# EAGLE board controller (EAGLE 9.6.2)
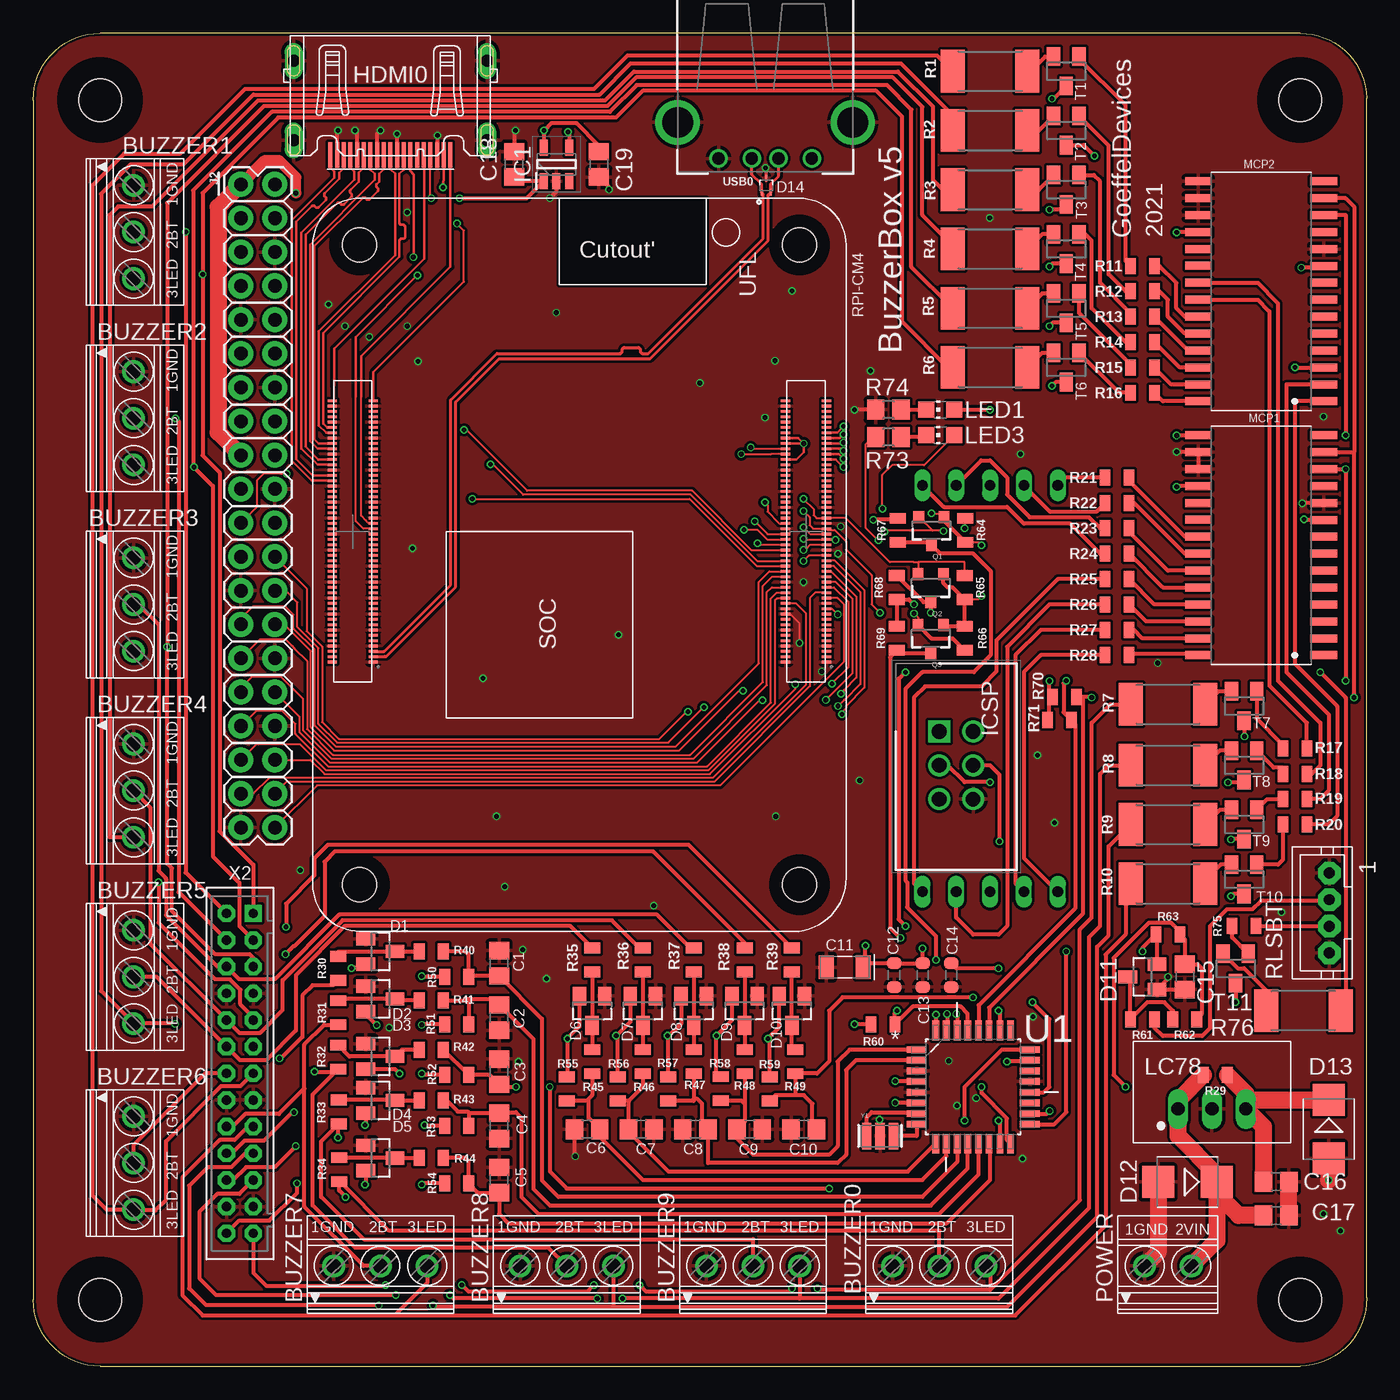
[diagram p3: board, top side]
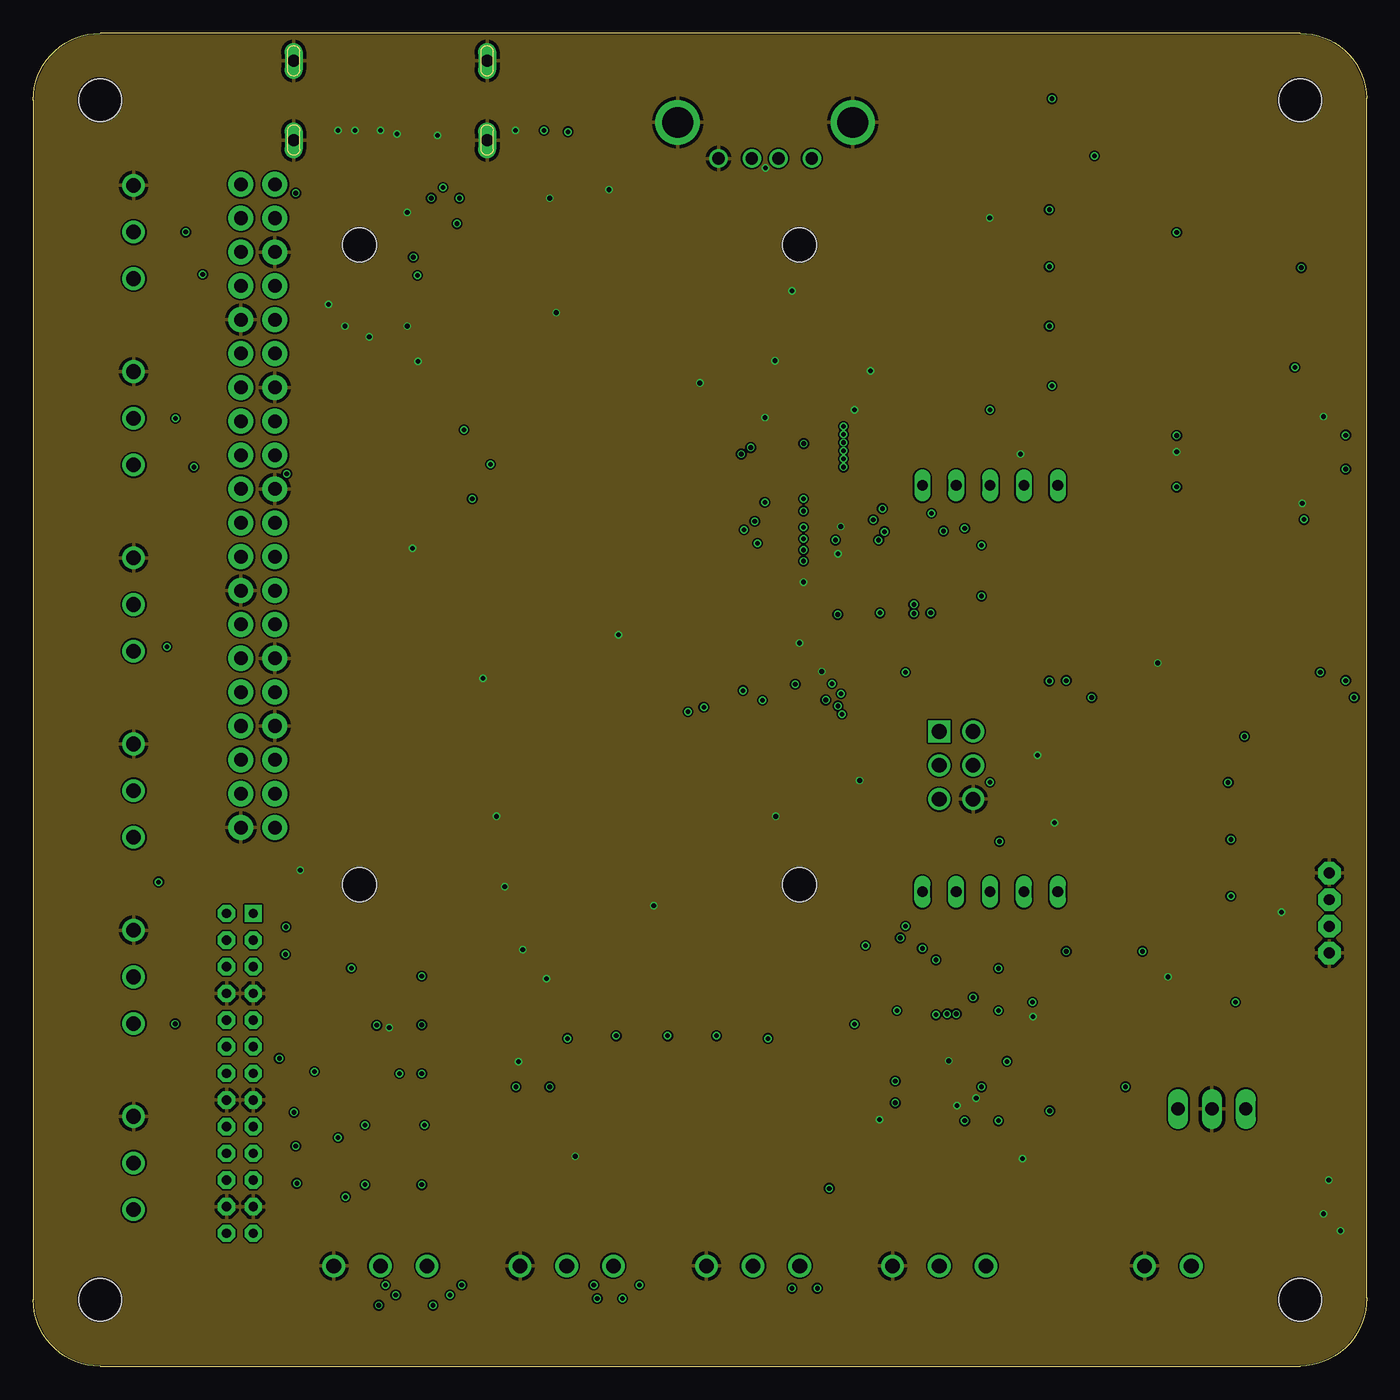
[diagram p4: board, inner layer GND]
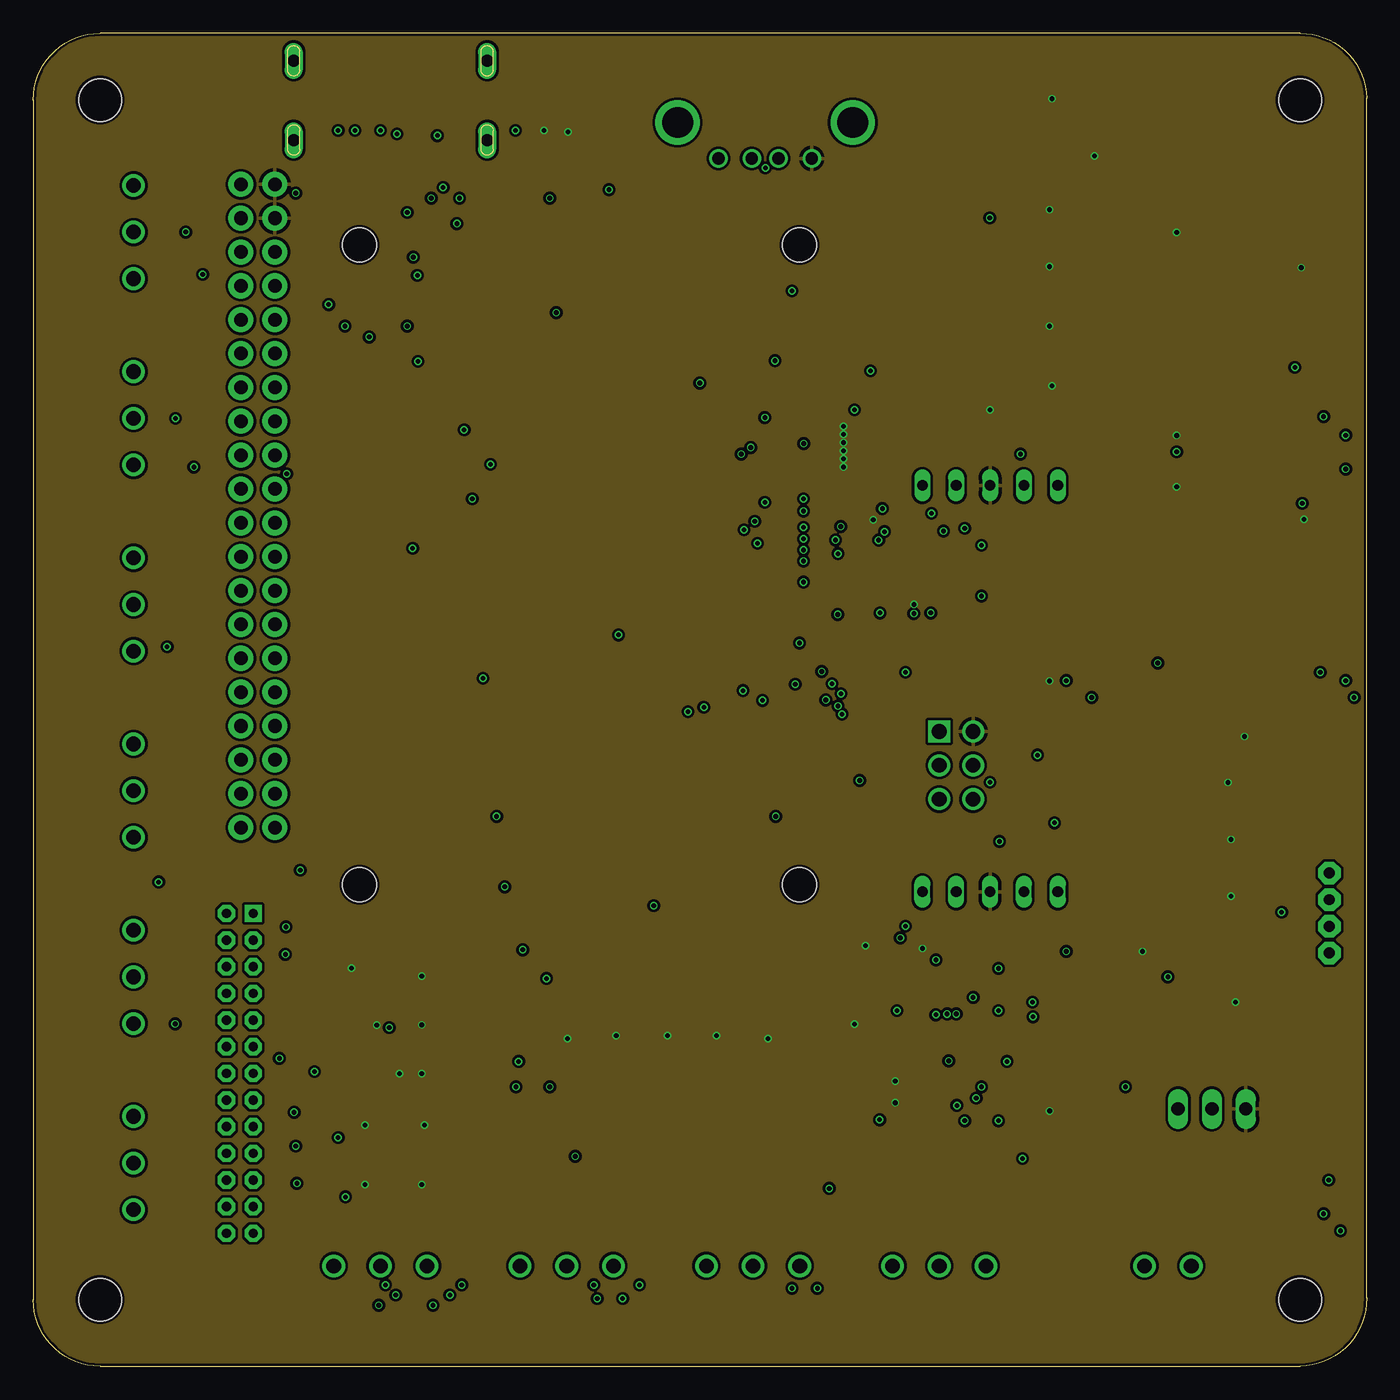
[diagram p5: board, inner layer 5V]
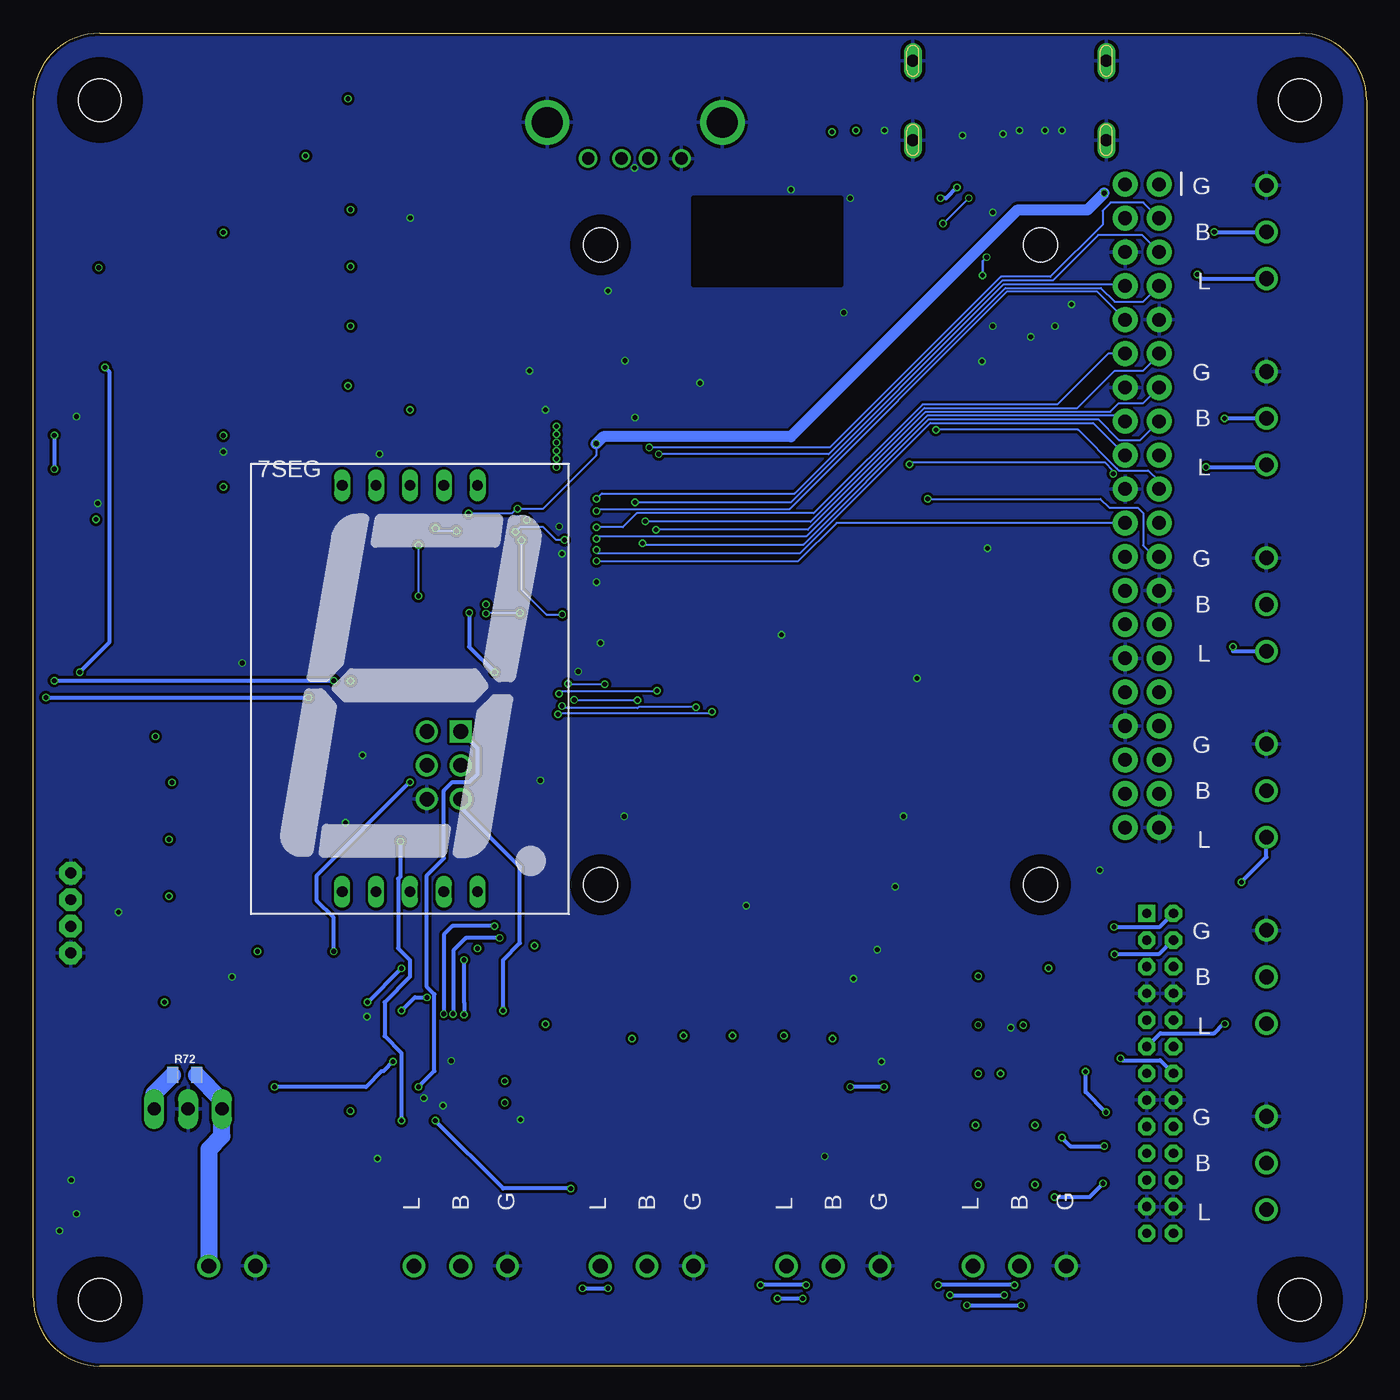
[diagram p6: board, bottom side, seen from below]

Size 100 x 100 mm. Coordinates in mm from the lower left corner, seen from the top.
Outline: 5,0 95,0 arc90 100,5.12 100,95.11 arc90 95,100 5,100 arc90 0,95 0,5 arc90 5,0
Copper layers (1*2*15*16): Top 0.035559375mm / dielectric 0.17018125mm / GND 0.01778125mm / dielectric 47mil / 5V 0.01778125mm / dielectric 0.17018125mm / Bottom 0.035559375mm
Design rules "jlcpcb-4-layer *": minimum track width 5mil, minimum drill 0.2mm, track to track 0.126490625mm, track to pad 0.126490625mm, pad to pad 0.126490625mm, via to via 0.126490625mm, smd to smd 0mil, copper to edge 0.1mm, drill to drill 5mil, minimum pad ring 4mil, minimum via ring 4mil, stop-mask expansion 3mil, vias tented up to drill 100mil, thermal gap 10mil
Net classes: 1 USB: width 0.229 mm, clearance 0.152 mm; 2 HDMI: width 0.175 mm, clearance 0.152 mm

## Footprints (pad centres in the part's own frame; a part is rotated, then mirrored left to right if it is on the bottom)
SA10-21 = drill 0.8 long: 1 -5.08,-15.2; 2 -2.54,-15.2; 3 0,-15.2; 4 2.54,-15.2; 5 5.08,-15.2; 6 5.08,15.28; 7 2.54,15.28; 8 0,15.28; 9 -2.54,15.28; 10 -5.08,15.28
1751251 = drill 1.1 pad 1.7: 1 -3.5,-0.1; 2 0,-0.1; 3 3.5,-0.1
C0805 = smd 1.3 x 1.5: 1 -0.95,0; 2 0.95,0
TAN-A = smd 1.118 x 1.778: 1 0,0; 2 2.794,0
C0603-ROUND = smd 0.898 x 1.1: 1 -0.889,0; 2 0.889,0
SOT23 = smd 1 x 1.4: 1 -0.95,-1.1; 2 0.95,-1.1; 3 0,1.1
SMB = smd 2.4 x 2.4: A 2.2,0; C -2.2,0
SOTFL35P100X50-3N = smd 0.46 x 0.2: 1 -0.52,0.35; 2 -0.52,-0.35; 3 0.52,0
HDMI_A = smd 0.3 x 1.9: P$1 4.5,3.95; P$2 4,3.95; P$3 3.5,3.95; P$4 3,3.95; P$5 2.5,3.95; P$6 2,3.95; P$7 1.5,3.95; P$8 1,3.95; P$9 0.5,3.95; P$10 0,3.95; P$11 -0.5,3.95; P$12 -1,3.95; P$13 -1.5,3.95; P$14 -2,3.95; P$15 -2.5,3.95; P$16 -3,3.95; P$17 -3.5,3.95; P$18 -4,3.95; P$19 -4.5,3.95 | drill 0.9 long: P$24 -7.25,2.84; P$25 -7.25,-3.12; P$26 7.25,2.84; P$27 7.25,-3.12
SOT95P280X145-5N = smd 1.2 x 0.6: 1 -1.25,0.95; 2 -1.25,0; 3 -1.25,-0.95; 4 1.25,-0.95; 5 1.25,0.95
SHDR6W64P254_2X3_1528X910X910P = drill 1.1 pad 1.65 square: 1 0,0 | drill 1.1 pad 1.65: 2 0,2.54; 3 2.54,0; 4 2.54,2.54; 5 5.08,0; 6 5.08,2.54
2X20 = drill 1.016 pad 1.88: 1 0,0; 2 0,2.54; 3 2.54,0; 4 2.54,2.54; 5 5.08,0; 6 5.08,2.54; 7 7.62,0; 8 7.62,2.54; 9 10.16,0; 10 10.16,2.54; 11 12.7,0; 12 12.7,2.54; 13 15.24,0; 14 15.24,2.54; 15 17.78,0; 16 17.78,2.54; 17 20.32,0; 18 20.32,2.54; 19 22.86,0; 20 22.86,2.54; 21 25.4,0; 22 25.4,2.54; 23 27.94,0; 24 27.94,2.54; 25 30.48,0; 26 30.48,2.54; 27 33.02,0; 28 33.02,2.54; 29 35.56,0; 30 35.56,2.54; 31 38.1,0; 32 38.1,2.54; 33 40.64,0; 34 40.64,2.54; 35 43.18,0; 36 43.18,2.54; 37 45.72,0; 38 45.72,2.54; 39 48.26,0; 40 48.26,2.54
CHIP-LED0805 = smd 1.2 x 1.2: A 0,-1.05; C 0,1.05
SOIC28 = smd 2 x 0.6: 1 -4.7,8.255; 2 -4.7,6.985; 3 -4.7,5.715; 4 -4.7,4.445; 5 -4.7,3.175; 6 -4.7,1.905; 7 -4.7,0.635; 8 -4.7,-0.635; 9 -4.7,-1.905; 10 -4.7,-3.175; 11 -4.7,-4.445; 12 -4.7,-5.715; 13 -4.7,-6.985; 14 -4.7,-8.255; 15 4.7,-8.255; 16 4.7,-6.985; 17 4.7,-5.715; 18 4.7,-4.445; 19 4.7,-3.175; 20 4.7,-1.906; 21 4.7,-0.635; 22 4.7,0.635; 23 4.7,1.905; 24 4.7,3.175; 25 4.7,4.445; 26 4.7,5.715; 27 4.7,6.985; 28 4.7,8.255
1751248 = drill 1.1 pad 1.7: 1 -1.75,-0.1; 2 1.75,-0.1
SOT23-3 = smd 0.8 x 0.9: 1 -0.95,-1; 2 0.95,-1; 3 0,1.1
R2512 = smd 1.8 x 3.2: 1 -2.8,0; 2 2.8,0
0805 = smd 0.8 x 1.2: 1 -0.9,0; 2 0.9,0
R0805 = smd 1.3 x 1.5: 1 -0.95,0; 2 0.95,0
JST-PH4 = drill 0.813 pad 1.676 octagon: 1 3,0; 2 1,0; 3 -1,0; 4 -3,0
RPI-CM4 = smd 0.2 x 0.7: 1 34.8,38.54; 2 34.8,35.46; 3 34.4,38.54; 4 34.4,35.46; 5 34,38.54; 6 34,35.46; 7 33.6,38.54; 8 33.6,35.46; 9 33.2,38.54; 10 33.2,35.46; 11 32.8,38.54; 12 32.8,35.46; 13 32.4,38.54; 14 32.4,35.46; 15 32,38.54; 16 32,35.46; 17 31.6,38.54; 18 31.6,35.46; 19 31.2,38.54; 20 31.2,35.46; 21 30.8,38.54; 22 30.8,35.46; 23 30.4,38.54; 24 30.4,35.46; 25 30,38.54; 26 30,35.46; 27 29.6,38.54; 28 29.6,35.46; 29 29.2,38.54; 30 29.2,35.46; 31 28.8,38.54; 32 28.8,35.46; 33 28.4,38.54; 34 28.4,35.46; 35 28,38.54; 36 28,35.46; 37 27.6,38.54; 38 27.6,35.46; 39 27.2,38.54; 40 27.2,35.46; 41 26.8,38.54; 42 26.8,35.46; 43 26.4,38.54; 44 26.4,35.46; 45 26,38.54; 46 26,35.46; 47 25.6,38.54; 48 25.6,35.46; 49 25.2,38.54; 50 25.2,35.46; 51 24.8,38.54; 52 24.8,35.46; 53 24.4,38.54; 54 24.4,35.46; 55 24,38.54; 56 24,35.46; 57 23.6,38.54; 58 23.6,35.46; 59 23.2,38.54; 60 23.2,35.46; 61 22.8,38.54; 62 22.8,35.46; 63 22.4,38.54; 64 22.4,35.46; 65 22,38.54; 66 22,35.46; 67 21.6,38.54; 68 21.6,35.46; 69 21.2,38.54; 70 21.2,35.46; 71 20.8,38.54; 72 20.8,35.46; 73 20.4,38.54; 74 20.4,35.46; 75 20,38.54; 76 20,35.46; 77 19.6,38.54; 78 19.6,35.46; 79 19.2,38.54; 80 19.2,35.46; 81 18.8,38.54; 82 18.8,35.46; 83 18.4,38.54; 84 18.4,35.46; 85 18,38.54; 86 18,35.46; 87 17.6,38.54; 88 17.6,35.46; 89 17.2,38.54; 90 17.2,35.46; 91 16.8,38.54; 92 16.8,35.46; 93 16.4,38.54; 94 16.4,35.46; 95 16,38.54; 96 16,35.46; 97 15.6,38.54; 98 15.6,35.46; 99 15.2,38.54; 100 15.2,35.46; 101 34.8,4.54; 102 34.8,1.46; 103 34.4,4.54; 104 34.4,1.46; 105 34,4.54; 106 34,1.46; 107 33.6,4.54; 108 33.6,1.46; 109 33.2,4.54; 110 33.2,1.46; 111 32.8,4.54; 112 32.8,1.46; 113 32.4,4.54; 114 32.4,1.46; 115 32,4.54; 116 32,1.46; 117 31.6,4.54; 118 31.6,1.46; 119 31.2,4.54; 120 31.2,1.46; 121 30.8,4.54; 122 30.8,1.46; 123 30.4,4.54; 124 30.4,1.46; 125 30,4.54; 126 30,1.46; 127 29.6,4.54; 128 29.6,1.46; 129 29.2,4.54; 130 29.2,1.46; 131 28.8,4.54; 132 28.8,1.46; 133 28.4,4.54; 134 28.4,1.46; 135 28,4.54; 136 28,1.46; 137 27.6,4.54; 138 27.6,1.46; 139 27.2,4.54; 140 27.2,1.46; 141 26.8,4.54; 142 26.8,1.46; 143 26.4,4.54; 144 26.4,1.46; 145 26,4.54; 146 26,1.46; 147 25.6,4.54; 148 25.6,1.46; 149 25.2,4.54; 150 25.2,1.46; 151 24.8,4.54; 152 24.8,1.46; 153 24.4,4.54; 154 24.4,1.46; 155 24,4.54; 156 24,1.46; 157 23.6,4.54; 158 23.6,1.46; 159 23.2,4.54; 160 23.2,1.46; 161 22.8,4.54; 162 22.8,1.46; 163 22.4,4.54; 164 22.4,1.46; 165 22,4.54; 166 22,1.46; 167 21.6,4.54; 168 21.6,1.46; 169 21.2,4.54; 170 21.2,1.46; 171 20.8,4.54; 172 20.8,1.46; 173 20.4,4.54; 174 20.4,1.46; 175 20,4.54; 176 20,1.46; 177 19.6,4.54; 178 19.6,1.46; 179 19.2,4.54; 180 19.2,1.46; 181 18.8,4.54; 182 18.8,1.46; 183 18.4,4.54; 184 18.4,1.46; 185 18,4.54; 186 18,1.46; 187 17.6,4.54; 188 17.6,1.46; 189 17.2,4.54; 190 17.2,1.46; 191 16.8,4.54; 192 16.8,1.46; 193 16.4,4.54; 194 16.4,1.46; 195 16,4.54; 196 16,1.46; 197 15.6,4.54; 198 15.6,1.46; 199 15.2,4.54; 200 15.2,1.46 | hole 2.55: 3.5,3.5; 3.5,36.5; 51.5,36.5; 51.5,3.5
QFP80P900X900X120-32N = smd 1.473 x 0.508: 1 -4.242,2.794; 2 -4.242,2.007; 3 -4.242,1.194; 4 -4.242,0.406; 5 -4.242,-0.406; 6 -4.242,-1.194; 7 -4.242,-2.007; 8 -4.242,-2.794; 17 4.242,-2.794; 18 4.242,-2.007; 19 4.242,-1.194; 20 4.242,-0.406; 21 4.242,0.406; 22 4.242,1.194; 23 4.242,2.007; 24 4.242,2.794 | smd 0.508 x 1.473: 9 -2.794,-4.242; 10 -2.007,-4.242; 11 -1.194,-4.242; 12 -0.406,-4.242; 13 0.406,-4.242; 14 1.194,-4.242; 15 2.007,-4.242; 16 2.794,-4.242; 25 2.794,4.242; 26 2.007,4.242; 27 1.194,4.242; 28 0.406,4.242; 29 -0.406,4.242; 30 -1.194,4.242; 31 -2.007,4.242; 32 -2.794,4.242
M3-HOLE = hole 3.2: 0,0
GAPTECLC78 = drill 1 long: P$1 -2.54,0; P$2 0,0; P$3 2.54,0
USB-A-S-SILK-FEMALE = drill 0.92: D+ 5.71,-1; D- 5.71,1; GND 5.71,-3.5; VBUS 5.71,3.5 | drill 2.311: SHLD1 3,-6.57; SHLD2 3,6.57
B26B-PHDSS = drill 0.7 pad 1.3 square: 1 12,-1 | drill 0.7 pad 1.3 octagon: 2 12,1; 3 10,-1; 4 10,1; 5 8,-1; 6 8,1; 7 6,-1; 8 6,1; 9 4,-1; 10 4,1; 11 2,-1; 12 2,1; 13 0,-1; 14 0,1; 15 -2,-1; 16 -2,1; 17 -4,-1; 18 -4,1; 19 -6,-1; 20 -6,1; 21 -8,-1; 22 -8,1; 23 -10,-1; 24 -10,1; 25 -12,-1; 26 -12,1
RESONATOR = smd 0.7 x 2: 1 -1,0; 2 0,0; 3 1,0

## Placement (x,y rotation side)
7SEG  7-SEG_SA10-21  [SA10-21]  71.75,50.8 0 bottom
BUZZER0  1751251  [1751251]  67.94,7.62 0 top
BUZZER1  1751251  [1751251]  7.62,85.09 270 top
BUZZER2  1751251  [1751251]  7.62,71.12 270 top
BUZZER3  1751251  [1751251]  7.62,57.15 270 top
BUZZER4  1751251  [1751251]  7.62,43.18 270 top
BUZZER5  1751251  [1751251]  7.62,29.21 270 top
BUZZER6  1751251  [1751251]  7.62,15.24 270 top
BUZZER7  1751251  [1751251]  26.04,7.62 0 top
BUZZER8  1751251  [1751251]  40.01,7.62 0 top
BUZZER9  1751251  [1751251]  53.98,7.62 0 top
C1  100nF  [C0805]  34.92,30.23 90 top
C2  100nF  [C0805]  34.92,26.16 270 top
C3  100nF  [C0805]  34.92,22.1 90 top
C4  100nF  [C0805]  34.92,18.03 270 top
C5  100nF  [C0805]  34.92,13.97 90 top
C6  100nF  [C0805]  41.53,17.78 180 top
C7  100nF  [C0805]  45.59,17.78 0 top
C8  100nF  [C0805]  49.66,17.78 180 top
C9  100nF  [C0805]  53.72,17.78 0 top
C10  100nF  [C0805]  57.78,17.78 180 top
C11  4,7uF_16V  [TAN-A]  62.25,29.93 180 top
C12  1uF  [C0603-ROUND]  64.56,29.34 270 top
C13  1uF  [C0603-ROUND]  66.69,29.34 270 top
C14  100nF  [C0603-ROUND]  68.83,29.34 270 top
C15  100nF  [C0805]  86.36,29.21 270 top
C16  22uF  [C0805]  93.22,13.84 180 top
C17  10uF  [C0805]  93.22,11.3 0 top
C18  100nF  [C0805]  36.06,90.17 90 top
C19  100nF  [C0805]  42.41,90.17 270 top
D1  HSMS-2852  [SOT23]  26.04,31.11 270 top
D2  HSMS-2852  [SOT23]  26.04,27.56 270 top
D3  HSMS-2852  [SOT23]  26.04,23.24 270 top
D4  HSMS-2852  [SOT23]  26.04,19.94 270 top
D5  HSMS-2852  [SOT23]  26.04,15.62 270 top
D6  HSMS-2852  [SOT23]  41.91,26.67 180 top
D7  HSMS-2852  [SOT23]  45.72,26.67 180 top
D8  HSMS-2852  [SOT23]  49.53,26.67 180 top
D9  HSMS-2852  [SOT23]  53.34,26.67 180 top
D10  HSMS-2852  [SOT23]  56.9,26.67 180 top
D11  HSMS-2852  [SOT23]  83.19,29.21 90 top
D12  [SMB]  86.56,13.82 180 top
D13  [SMB]  97.16,17.78 270 top
D14  TPD2EUSB30DRTR  [SOTFL35P100X50-3N]  54.96,88.6 90 top
HDMI0  HDMI-A  [HDMI_A]  26.78,94.82 180 top
IC1  TPS2041CDBVT  [SOT95P280X145-5N]  39.23,90.17 90 top
ICSP  61200621621  [SHDR6W64P254_2X3_1528X910X910P]  67.94,47.62 270 top
J2  RASPBERRYPI-40-PIN-GPIO_PTH_NO_SHROUD  [2X20]  15.57,88.67 270 top
LED1  red  [CHIP-LED0805]  68.02,71.75 90 top
LED3  green  [CHIP-LED0805]  68.02,69.85 90 top
MCP1  MCP23017-E/SO  [SOIC28]  92.08,61.59 180 top
MCP2  MCP23017-E/SO  [SOIC28]  92.08,80.64 180 top
POWER  1751248  [1751248]  85.09,7.62 0 top
Q1  BSS138  [SOT23-3]  67.36,62.71 180 top
Q2  BSS138  [SOT23-3]  67.31,58.42 180 top
Q3  BSS138  [SOT23-3]  67.31,54.61 180 top
R1  50  [R2512]  71.75,97.16 0 top
R2  50  [R2512]  71.75,92.71 0 top
R3  50  [R2512]  71.75,88.27 0 top
R4  50  [R2512]  71.75,83.82 0 top
R5  50  [R2512]  71.75,79.38 0 top
R6  50  [R2512]  71.75,74.93 0 top
R7  50  [R2512]  85.09,49.66 0 top
R8  50  [R2512]  85.09,45.09 0 top
R9  50  [R2512]  85.09,40.64 0 top
R10  50  [R2512]  85.09,36.2 0 top
R11  1K  [0805]  83.19,82.55 180 top
R12  1K  [0805]  83.19,80.64 180 top
R13  1K  [0805]  83.19,78.74 180 top
R14  1K  [0805]  83.19,76.83 180 top
R15  1K  [0805]  83.19,74.93 180 top
R16  1K  [0805]  83.19,73.03 180 top
R17  1K  [0805]  94.61,46.35 180 top
R18  1K  [0805]  94.61,44.45 180 top
R19  1K  [0805]  94.61,42.55 180 top
R20  1K  [0805]  94.61,40.64 180 top
R21  150  [0805]  81.28,66.67 180 top
R22  150  [0805]  81.28,64.77 180 top
R23  150  [0805]  81.28,62.87 180 top
R24  150  [0805]  81.28,60.96 180 top
R25  150  [0805]  81.28,59.05 180 top
R26  150  [0805]  81.28,57.15 180 top
R27  150  [0805]  81.28,55.24 180 top
R28  150  [0805]  81.28,53.34 180 top
R29  0  [0805]  88.65,21.84 180 top
R30  10  [0805]  22.86,29.84 90 top
R31  10  [0805]  22.86,26.52 90 top
R32  10  [0805]  22.86,23.19 90 top
R33  10  [0805]  22.91,19.08 90 top
R34  10  [0805]  22.94,14.76 90 top
R35  10  [0805]  41.91,30.48 270 top
R36  10  [0805]  45.72,30.48 270 top
R37  10  [0805]  49.53,30.48 270 top
R38  10  [0805]  53.34,30.48 270 top
R39  10  [0805]  56.9,30.48 270 top
R40  1k  [0805]  29.84,31.11 0 top
R41  1k  [0805]  29.84,27.43 0 top
R42  1k  [0805]  29.84,23.75 0 top
R43  1k  [0805]  29.84,19.94 0 top
R44  1k  [0805]  29.84,15.62 0 top
R45  1k  [0805]  41.91,22.86 270 top
R46  1k  [0805]  45.72,22.86 270 top
R47  1k  [0805]  49.53,22.86 270 top
R48  1k  [0805]  53.34,22.86 270 top
R49  1k  [0805]  57.15,22.86 270 top
R50  100k  [0805]  31.75,29.21 180 top
R51  100k  [0805]  31.75,25.65 180 top
R52  100k  [0805]  31.75,21.84 180 top
R53  100k  [0805]  31.75,18.03 180 top
R54  100k  [0805]  31.75,13.72 180 top
R55  100k  [0805]  40.01,20.8 90 top
R56  100k  [0805]  43.81,20.8 90 top
R57  100k  [0805]  47.62,20.8 90 top
R58  100k  [0805]  51.56,20.83 90 top
R59  100k  [0805]  55.24,20.8 90 top
R60  10K  [0805]  63.72,25.64 180 top
R61  10  [0805]  83.19,26.04 180 top
R62  1k  [0805]  86.36,26.04 0 top
R63  100k  [0805]  85.09,32.38 180 top
R64  10K  [0805]  69.9,62.71 270 top
R65  10K  [0805]  69.85,58.42 270 top
R66  10K  [0805]  69.85,54.61 90 top
R67  10K  [0805]  64.82,62.71 90 top
R68  10K  [0805]  64.77,58.42 270 top
R69  10K  [0805]  64.77,54.61 90 top
R70  [0805]  77.34,50.19 180 top
R71  [0805]  76.96,48.46 180 top
R72  0  [0805]  88.65,21.84 0 bottom
R73  1k  [R0805]  64.14,69.7 180 top
R74  1k  [R0805]  64.14,71.75 180 top
R75  1K  [0805]  90.81,33.02 180 top
R76  50  [R2512]  95.25,26.67 180 top
RLSBT  [JST-PH4]  97.2,34 90 top
RPI-CM4  RPI-CM4  [RPI-CM4]  20.95,87.63 270 top
T1  BC849  [SOT23]  77.47,97.16 180 top
T2  BC849  [SOT23]  77.47,92.71 180 top
T3  BC849  [SOT23]  77.47,88.27 180 top
T4  BC849  [SOT23]  77.47,83.82 180 top
T5  BC849  [SOT23]  77.47,79.38 180 top
T6  BC849  [SOT23]  77.47,74.93 180 top
T7  BC849  [SOT23]  90.81,49.53 180 top
T8  BC849  [SOT23]  90.81,45.09 180 top
T9  BC849  [SOT23]  90.81,40.64 180 top
T10  BC849  [SOT23]  90.81,36.53 180 top
T11  BC849  [SOT23]  90.17,29.84 180 top
U1  ATMEGA328P-AU  [QFP80P900X900X120-32N]  70.48,20.95 0 top
U$1  [M3-HOLE]  5,5 0 top
U$2  [M3-HOLE]  95,95 0 top
U$3  [M3-HOLE]  95,5 0 top
U$4  [M3-HOLE]  5,95 0 top
U$5  GAPTECCLC78  [GAPTECLC78]  88.39,19.3 0 top
USB0  USB_A_SMT_FEMALE  [USB-A-S-SILK-FEMALE]  54.89,96.32 270 top
X2  B26B-PHDSS  [B26B-PHDSS]  15.49,21.97 90 top
Y1  16MHz  [RESONATOR]  63.5,17.27 0 top

## Tracks (layer width: path | path; a pad name or v marks a point on that pad's centre or on a via)
5VHDMI  (via drill 0.35)
  Top 0.203: v30.73,88.44 30.73,88.92 30.78,88.96 HDMI0.P$18
  Top 0.305: v31.96,87.63 36.99,87.63 IC1.1 36.36,88.92 C18.1
  Bottom 0.305: v30.73,88.44 31.55,87.63 v31.96,87.63
+3V3  (via drill 0.35)
  Top 0.152: v67.36,63.98 68.04,63.98 Q1.1 | R64.2 70.9,61.81 v71.12,61.59 | v71.12,57.78 70.86,57.52 R65.2 | LED3.A 66.81,67.6 64.4,67.6 63.68,66.88 v63.68,64.34
  Top 0.203: v57.77,69.23 v57.78,69.22 57.78,68.58 57.23,68.03 RPI-CM4.78 | RPI-CM4.86 57.37,69.63 v57.77,69.23 | RPI-CM4.84 v57.77,69.23
  Top 0.305: R64.2 68.31,63.4 Q1.1 | Q2.1 68.26,58.74 68.58,58.42 68.95,58.42 R65.2 R66.2 68.36,55.51 Q3.1
  Top 0.813: J2.1 16.31,89.41 16.31,89.42 17.36,90.47 18.41,90.47 19.68,89.2 v19.68,88.01
  Top 1.27: J2.17 13.86,70.07 13.86,86.96 J2.1
  Bottom 0.152: v57.78,69.22 57.78,68.33 61.77,64.34 v63.68,64.34 63.68,64.41 64.11,63.98 v67.36,63.98 | v71.12,61.59 v71.12,57.78
  Bottom 0.813: v19.68,88.01 20.93,86.77 26.16,86.77 43.19,69.73 57.27,69.73 v57.78,69.22
+5V  (via drill 0.35)
  Top 0.203: RPI-CM4.87 60.28,70.03 v60.76,70.51 | RPI-CM4.85 60.49,69.63 v60.76,69.9 | RPI-CM4.83 60.7,69.23 v60.76,69.29 | RPI-CM4.81 60.61,68.83 v60.76,68.68 | RPI-CM4.79 60.4,68.43 v60.76,68.07 | RPI-CM4.77 60.19,68.03 v60.76,67.46
  Top 0.305: D6.2 40.96,25.49 v40.06,24.59 40.06,21.75 R55.2 | R56.2 43.81,24.69 v43.71,24.79 44.77,25.85 D7.2 | R57.2 47.62,24.74 | 47.62,24.74 v47.57,24.79 | R58.2 51.23,21.73 v51.23,24.79 52.39,25.95 D9.2 | R59.2 55.24,24.43 v55.09,24.59 55.91,25.4 55.91,27.73 D10.2 | D8.2 48.58,25.7 47.62,24.74 | R50.2 29.18,29.21 v29.13,29.26 | R51.2 29.18,25.65 v29.13,25.6 | R52.2 29.23,21.84 v29.13,21.95 | R53.2 29.39,18.03 v29.34,18.09 | R54.2 29.23,13.72 v29.13,13.61 | D5.2 24.93,13.68 v24.87,13.61 | D4.2 24.93,18.15 v24.87,18.09 | v27.46,21.95 27.11,22.29 D3.2 | v25.76,25.58 24.93,26.4 D2.2 | D1.2 24.64,29.87 v23.85,29.87 | MCP2.18 87.35,85.06 v85.75,85.06 | MCP2.9 96.65,82.42 v95.1,82.42 | T1.3 76.51,95.1 v76.4,95.1 | v79.58,90.81 78.77,91.61 T2.3 | T3.3 77.07,86.77 v76.2,86.77 | T4.3 76.42,82.72 v76.2,82.5 | T5.3 76.45,78.28 v76.2,78.03 | T6.3 76.67,73.83 v76.4,73.56 | MCP1.15 87.35,69.83 v85.75,69.83 | MCP1.18 85.83,66.04 v85.75,65.96 | MCP1.9 95.33,63.5 v95.3,63.52 | T7.3 90.81,47.27 v90.83,47.24 | T8.3 90.61,43.79 v89.61,43.79 | T9.3 89.83,39.54 v89.81,39.52 | T10.3 89.98,35.42 v89.81,35.26 | R60.2 62.8,25.65 v61.59,25.65 | C11.1 62.41,30.09 | 62.41,30.09 v62.41,31.55 | v66.67,31.34 66.69,31.32 C13.1 C12.1 62.54,30.22 62.41,30.09 | U1.4 64.67,21.36 v64.64,21.39 | U1.6 v64.64,19.76 | R67.2 64.71,63.5 v62.99,63.5 | U1.18 76.02,18.95 v76.22,19.15 | R70.2 76.2,49.95 | 76.2,49.95 v76.2,51.41 | R71.2 76.2,48.6 76.2,49.95 | R69.2 R68.2 65.67,57.52 v66.04,57.15 | D11.2 84.28,32.29 R63.2 83.19,31.38 v83.19,31.11 | LED1.A v71.75,71.75 | T11.3 v90.17,27.3 | v40.1,92.61 40.19,92.53 IC1.4 | IC1.5 38.28,92.69 v38.3,92.71 38.83,93.24 40.74,93.24 42.41,91.58 C19.1
  Top 1.27: C16.2 92.27,17.97 U$5.P$3 | U$5.P$3 90.93,20.46 R72.1 | U$5.P$3 91.61,19.98 D13.C
  Bottom 1.27: U$5.P$3 90.93,20.46 R72.1
  pour 5V (isolate 0.203, rank 6): -5.54,-5.76 -5.54,105.95 120.01,105.95 120.01,-5.39
+12V
  Top 0.305: 88.76,12.94 D12.C
  Top 1.27: POWER.2 88.76,9.44 D12.C 88.76,14.36 85.85,17.27 U$5.P$1 85.85,19.95 R72.2 | C17.1 90.4,11.3 88.76,12.94
  Bottom 1.27: POWER.2 86.84,16.28 85.85,17.27 U$5.P$1 85.85,19.95 R72.2
A
  Top 0.305: R23.2 80.01,62.87 79.17,63.7 74.73,63.7 73.03,65.41 73.03,66.67 71.75,67.94 71.08,67.94 7SEG.7
A0  (via drill 0.35)
  Top 0.305: U1.23 74.62,22.86 v73.03,22.86 | v81.92,20.95 81.03,21.84 81.03,30.61 83.67,33.26 85.34,33.26 85.99,32.61 R63.1 86.36,32.02 C15.1 87.31,30.16 87.63,29.84 87.63,26.41 R62.2
  Bottom 0.305: v73.03,22.86 73.74,22.15 73.85,22.15 75.05,20.95 v81.92,20.95
A1  (via drill 0.35)
  Top 0.305: R42.2 R52.1 34.23,21.84 C3.1 35.12,20.95 v36.2,20.95 | v38.73,20.95 38.73,14.61 40.01,13.34 v59.69,13.34 | v69.85,18.41 69.85,20.95 72.64,23.75 U1.24
  Bottom 0.305: v36.2,20.95 v38.73,20.95 | v59.69,13.34 64.77,13.34 v69.85,18.41
A3  (via drill 0.35)
  Top 0.305: C10.1 58.42,18.09 58.42,19.68 57.78,20.32 57.15,20.32 | 57.15,20.32 55.66,20.32 R59.1 | 57.15,20.32 R49.2 58.79,21.96 59.69,22.86 59.69,26.67 60.69,27.67 v70.48,27.67 | v72.39,26.67 72.49,26.57 U1.26
  Bottom 0.305: v70.48,27.67 71.39,27.67 v72.39,26.67
B
  Top 0.305: R24.2 80.01,60.96 77.77,63.2 74.3,63.2 73.03,64.47 68.28,64.47 7SEG.6
BUZZ0  (via drill 0.35)
  Top 0.305: BUZZER0.2 67.94,10.16 26.67,10.16 22.97,13.86 R34.1 22.94,13.18 v23.41,12.7 | v19.77,13.72 19.77,12.99 17.7,10.93 15.45,10.93 X2.26
  Bottom 0.305: v23.41,12.7 20.78,12.7 v19.77,13.72
BUZZ1  (via drill 0.35)
  Top 0.305: R39.1 56.88,31.38 49.15,39.12 22.1,39.12 21.08,38.1 21.08,36.83 18.95,34.7 v18.95,32.96 | v11.43,85.09 11.43,37.03 X2.2
  Bottom 0.305: v11.43,85.09 BUZZER1.2 | v18.95,32.96 15.5,32.96 X2.2
BUZZ2  (via drill 0.35)
  Top 0.305: R38.1 53.6,31.38 53.6,31.48 46.48,38.61 22.61,38.61 21.84,37.85 21.84,33.78 19.59,31.53 19.53,31.53 v18.9,30.9 | v10.67,71.12 10.89,70.89 10.89,35.57 X2.4
  Bottom 0.305: v10.67,71.12 BUZZER2.2 | X2.4 14.53,31.97 15.6,30.9 v18.9,30.9
BUZZ3
  Top 0.305: R37.1 49.27,31.38 46.76,33.88 22.96,33.88 18.1,29.02 15.44,29.02 X2.6 13.82,29.97 9.95,33.83 9.95,36.55 9.94,36.56 9.94,36.61 9.4,37.16 9.4,55.63 7.87,57.15 BUZZER3.2
BUZZ4
  Top 0.305: R36.1 45.45,31.38 43.38,33.45 23.19,33.45 18.7,28.96 18.7,26.72 17,25.02 15.44,25.02 X2.10 8.76,31.7 8.76,41.94 BUZZER4.2
BUZZ5
  Top 0.305: R35.1 40.27,33.02 23.37,33.02 19.68,29.34 19.68,25.18 17.46,22.96 15.5,22.96 X2.12 9.25,29.21 BUZZER5.2
BUZZ6  (via drill 0.35)
  Top 0.305: v18.45,23.09 18.57,23.09 20.18,24.7 20.18,27.8 20.95,28.57 22.49,28.57 R30.1 | X2.14 12.89,21.97 7.52,16.59 BUZZER6.2
  Bottom 0.305: v18.45,23.09 18.32,22.96 15.48,22.96 X2.14
BUZZ7
  Top 0.305: BUZZER7.2 24.77,7.52 20.32,11.96 20.32,20.83 | R31.1 21.81,25.62 20.32,24.13 20.32,20.83 | 20.32,20.83 18.42,18.93 15.88,18.93 14.92,17.97 X2.18
BUZZ8  (via drill 0.35)
  Top 0.305: BUZZER8.2 38.63,8.89 24.13,8.89 20.95,12.06 20.95,20.39 R32.1 22.67,22.1 v21.08,22.1 | X2.20 14.89,15.97 15.85,16.93 17.3,16.93 19.42,19.05 v19.56,19.05
  Bottom 0.305: v19.56,19.05 21.08,20.57 v21.08,22.1
BUZZ9  (via drill 0.35)
  Top 0.305: BUZZER9.2 53.98,9.53 24.77,9.53 21.59,12.7 21.59,16.86 R33.1 22.86,18.12 v22.86,17.14 | v19.68,16.51 18.1,14.93 15.95,14.93 14.99,13.97 X2.22
  Bottom 0.305: v22.86,17.14 22.23,16.51 v19.68,16.51
C
  Top 0.305: R26.2 76.2,57.15 73.03,53.98 73.03,33.02 72.39,32.38 70.48,32.38 69.22,33.66 7SEG.4
D
  Top 0.305: R27.2 75.56,55.24 73.66,53.34 73.66,36.23 7SEG.2
D2  (via drill 0.35)
  Top 0.305: R67.1 67.16,61.81 Q1.3 67.98,60.99 70.45,60.99 71.81,59.64 71.81,53.34 70.54,52.07 66.67,52.07 65.41,50.8 65.41,36.45 65.53,36.32 65.53,34.43 67.71,32.26 v67.71,30.48 | v67.69,26.36 U1.32
  Bottom 0.305: v67.71,30.48 67.71,27.32 67.69,27.3 v67.69,26.36
D3
  Top 0.305: R48.2 53.34,19.68 | 53.34,19.68 53.34,18.35 C9.1 52.77,17.14 52.74,17.11 53.98,15.88 59.69,15.88 60.33,16.51 60.33,22.86 61.21,23.75 U1.1 | R58.1 53.1,19.93 53.34,19.68
D4
  Top 0.305: 49.53,20.05 49.8,20.05 50.16,19.68 50.16,18.22 C8.1 50.61,15.24 60.33,15.24 60.96,15.88 60.96,22.23 61.7,22.96 U1.2 | R57.1 49.53,19.9 49.53,20.05 | R47.2 49.53,20.05
D5
  Top 0.305: R46.2 45.72,20.95 44.67,19.9 | 44.67,19.9 R56.1 | 44.67,19.9 44.64,19.88 C7.1 44.64,17.59 47.62,14.61 65.58,14.61 U1.9
D6
  Top 0.305: R45.2 41.91,20.32 41.65,20.05 41.65,19.9 | 41.65,19.9 R55.1 | 41.65,19.9 41.65,18.61 C6.1 42.55,17.71 42.55,17.14 45.72,13.97 66.67,13.97 68.48,15.77 U1.10
D7
  Top 0.305: R40.2 32.38,31.11 32.65,30.85 R50.1 32.72,29.28 C1.1 38.13,26.07 38.13,13.94 39.37,12.7 66.67,12.7 69.29,15.32 U1.11
D8
  Top 0.305: R41.2 32.51,27.43 | 32.51,27.43 32.38,27.56 34.48,27.56 C2.1 37.49,24.54 37.49,13.3 38.73,12.06 67.31,12.06 70.08,14.83 U1.12 | 32.51,27.43 32.65,27.29 R51.1
D9
  Top 0.305: R43.2 30.99,19.94 31.82,19.11 32.58,19.11 32.65,19.04 | 32.65,19.04 R53.1 | 32.65,19.04 32.7,18.98 C4.1 34.99,19.05 36.2,19.05 36.61,18.64 36.61,12.7 37.88,11.43 67.94,11.43 70.89,14.38 U1.13
D10
  Top 0.305: R44.2 32.38,15.62 32.65,15.36 R54.1 33.35,13.02 C5.1 34.92,11.43 35.62,10.73 68.52,10.73 71.75,13.97 71.75,16.64 U1.14
DP
  Top 0.305: R25.2 76.83,59.05 72.24,54.46 72.24,52.12 71.12,51 66.88,51 66.04,50.16 66.04,36.23 7SEG.5
E
  Top 0.305: R28.2 75.56,53.34 74.3,52.07 74.3,38.14 7SEG.1
F
  Top 0.305: R22.2 79.75,64.14 76.24,64.14 7SEG.9
G
  Top 0.305: 7SEG.10 77.43,66.67 R21.2
GND  (via drill 0.35)
  Top 0.152: v57.45,54.25 57.45,55.74 56.77,56.43 RPI-CM4.20 RPI-CM4.22
  Top 0.229: D14.3 54.96,89.84 v54.9,89.9
  Top 0.305: HDMI0.P$11 v27.28,92.45 27.28,92.43 v27.28,92.46 | v30.3,92.33 30.3,90.89 HDMI0.P$17 | v85.75,68.61 85.78,68.58 MCP1.16 MCP1.17 | MCP1.10 96.75,64.75 v95.17,64.75 | Y1.2 63.48,17.3 v63.48,18.49 | C15.2 D11.1 85.09,29.07 v85.09,29.21 | C6.2 40.58,15.81 v40.64,15.75 | R74.2 v61.59,71.75 | HDMI0.P$2 22.78,92.63 v22.86,92.71 | HDMI0.P$5 24.28,92.56 v24.13,92.71 | HDMI0.P$8 25.78,92.45 v26.04,92.71 | IC1.2 39.23,88.13 v38.73,87.63 | v43.18,88.27 43.18,88.45 C19.2 | C18.2 36.06,92.61 v36.16,92.71
  Top 1.27: D12.A 84.36,8.54 POWER.1 | C17.2 C16.1 | D13.A v97.16,13.97
  other vias: 96.77,71.25 36.4,22.86 36.7,31.24 57.76,58.83 59.13,52.12 55.63,75.44 54.86,71.17 74.19,15.57 70.71,20.12 68.66,22.91 69.27,19.56 74.98,26.21 20.02,37.21 28.85,75.39 22.15,79.65 23.37,78.03 25.2,77.22 28.04,86.56 38.48,29.08 33.73,51.61 43.89,54.86 55.68,41.25 34.75,41.25 96.77,11.43 71.73,86.16 60.55,62.99 62.79,74.68 74.04,68.43 60.35,60.96 28.45,61.37 28.04,78.03 46.53,34.54 35.36,35.97 26.7,25.4 84.33,52.76 93.62,34.06 49.99,73.76 56.9,80.67 39.22,79.04 61.98,43.94 75.31,45.85 76.58,40.77 98.04,10.16
  pour GND (rank 6): -3.4,107.4 110.4,107.4 110.4,-2.93 -3.6,-2.93 -3.6,107.2
  pour Bottom (isolate 0.203): -5.22,-1.75 -5.22,109.95 115.01,109.95 115.01,-1.39
  pour Top (isolate 0.203): -20.9,-5.22 -20.9,106.49 105.05,106.49 105.05,-4.84
GP4  (via drill 0.35)
  Top 0.152: v54.86,64.81 55.06,64.61 55.06,64.1 55.94,63.23 RPI-CM4.54
  Bottom 0.152: v54.86,64.81 54.84,64.84 43.15,64.84 27.09,80.9 19.94,80.9 18.9,79.86 16.76,79.86 J2.7
GP5
  Top 0.152: RPI-CM4.34 55.42,59.23 54.71,58.52 54.71,51.33 49.25,45.87 22.47,45.87 20.54,47.8 20.54,52.89 19.57,53.86 19.38,54.05 18.92,54.51 16.97,54.51 J2.29
GP6
  Top 0.152: RPI-CM4.30 55.38,58.43 55.02,58.06 55.02,51.1 49.48,45.57 22.36,45.57 20.23,47.7 20.23,50.07 18.58,51.71 16.37,51.71 15.57,50.92 J2.31
GP7  (via drill 0.35)
  Top 0.152: v50.29,49.45 47.63,46.79 22.78,46.79 21.38,48.19 21.38,53.87 19.81,55.44 19.81,57.3 18.92,58.19 J2.26 | RPI-CM4.37 59.51,60.05 60.05,60.05 62.03,58.06 62.03,51.17 60.84,49.99 60.81,49.99 v60.35,49.53
  Bottom 0.152: v50.29,49.45 54.61,49.45 54.68,49.38 60.2,49.38 v60.35,49.53
GP8  (via drill 0.35)
  Top 0.152: J2.24 20.5,58.34 20.5,55.15 21.66,53.99 21.66,48.32 22.91,47.07 46.96,47.07 49,49.11 v49.11,49.11 | RPI-CM4.39 60.12,60.43 62.33,58.22 62.33,50.9 60.96,49.53 60.96,49.38 60.66,49.07 v60.66,48.92
  Bottom 0.152: v49.11,49.11 49.11,48.95 60.62,48.95 v60.66,48.92
GP9  (via drill 0.35)
  Top 0.152: v34.29,67.67 34.44,67.67 36.73,65.38 49.32,65.38 54.3,60.4 56.38,60.4 RPI-CM4.40 | v19.01,66.95 18.59,66.95 18.58,66.95 17.27,66.95 16.76,66.45 16.76,64.47 J2.21
  Bottom 0.152: v34.29,67.67 34.29,67.82 19.66,67.82 19.01,67.17 v19.01,66.95
GP10  (via drill 0.35)
  Top 0.152: v32.31,70.26 32.46,70.26 37.03,65.68 49.41,65.68 53.86,61.23 RPI-CM4.44
  Bottom 0.152: v32.31,70.26 21.64,70.26 18.75,67.36 18.73,67.36 18.58,67.21 16.38,67.21 15.57,66.4 J2.19
GP11  (via drill 0.35)
  Top 0.152: v32.92,65.08 49.23,65.08 54.27,60.03 RPI-CM4.38
  Bottom 0.152: J2.23 15.93,60.73 16.76,61.57 16.76,64.01 17.17,64.41 19.3,64.41 19.96,65.08 v32.92,65.08
GP12  (via drill 0.35)
  Top 0.152: J2.32 19.95,48.73 19.95,47.57 22.24,45.29 49.78,45.29 54.45,49.95 v54.69,49.95 | RPI-CM4.31 60.19,58.83 61.42,57.61 61.42,51.97 v59.44,49.99
  Bottom 0.152: v59.44,49.99 54.73,49.99 v54.69,49.95
GP13
  Top 0.152: RPI-CM4.28 55.74,58.03 55.32,57.61 55.32,49.79 50.53,45 22.11,45 19.66,47.45 19.66,48.18 18.67,49.17 16.71,49.17 J2.33
GP16  (via drill 0.35)
  Top 0.152: v57.15,51.16 57.15,50.82 50.75,44.42 21.84,44.42 20.78,45.49 J2.36 | v59.89,51.21 61.11,52.43 61.11,57.36 60.05,58.43 RPI-CM4.29
  Bottom 0.152: v57.15,51.16 59.85,51.16 v59.89,51.21
GP17  (via drill 0.35)
  Top 0.152: v54.1,63.38 54.28,63.21 54.29,63.21 55.07,62.43 RPI-CM4.50
  Bottom 0.152: v54.1,63.38 54.08,63.36 41.7,63.36 33.18,71.88 21.69,71.88 18.9,74.68 16.76,74.68 15.57,75.87 J2.11
GP18  (via drill 0.35)
  Top 0.152: v57.76,62.94 58.27,62.43 RPI-CM4.49
  Bottom 0.152: J2.12 19.38,75.97 23.19,72.16 33.3,72.16 41.47,63.99 54.74,63.99 55.79,62.94 v57.76,62.94
GP19
  Top 0.152: RPI-CM4.26 56.39,57.61 55.78,57.61 55.62,57.45 55.62,49.69 50.65,44.72 21.95,44.72 20.03,46.63 16.71,46.63 J2.35
GP20
  Top 0.152: RPI-CM4.27 58.64,58.03 58.24,57.63 58.24,51.02 51.09,43.87 19.02,43.87 J2.38
GP21
  Top 0.152: J2.40 21.29,43.59 51.51,43.59 60.81,52.88 60.81,57.15 60.33,57.63 RPI-CM4.25
GP22  (via drill 0.35)
  Top 0.152: v54.3,61.74 54.42,61.63 RPI-CM4.46
  Bottom 0.152: v54.3,61.74 54.21,61.65 42.23,61.65 32.83,71.04 20.14,71.04 18.59,69.49 16.97,69.49 J2.15
GP23  (via drill 0.35)
  Top 0.152: v57.76,62.07 57.8,62.03 RPI-CM4.47 60.09,62.03 60.15,61.98 v60.16,61.99 | v63.83,62.61 63.9,62.68 67.44,62.68 | 67.44,62.68 Q1.2 | 67.44,62.68 68.29,62.68 v68.27,62.66 | v69.85,62.87 69.9,62.92 R64.1
  Bottom 0.152: J2.16 18.54,71.32 32.95,71.32 42.02,62.25 57.58,62.25 v57.76,62.07 | v63.83,62.61 63.45,62.99 61.8,62.99 60.79,61.99 v60.16,61.99 | v68.27,62.66 69.64,62.66 v69.85,62.87
GP24  (via drill 0.35)
  Top 0.152: v57.76,61.24 57.88,61.24 58.28,61.63 RPI-CM4.45
  Bottom 0.152: J2.18 20.52,70.76 32.72,70.76 42.49,60.99 57.71,60.99 57.76,61.04 v57.76,61.24
GP25  (via drill 0.35)
  Top 0.152: RPI-CM4.41 59.47,60.81 58.16,60.81 v57.76,60.41
  Bottom 0.152: J2.22 39.75,63.27 42.62,60.41 v57.76,60.41
GP26
  Top 0.152: RPI-CM4.24 57.21,57.23 57.94,56.5 57.94,51.11 50.97,44.15 17.69,44.15 16.49,42.95 J2.37
GP27  (via drill 0.35)
  Top 0.152: v53.3,62.76 54.3,62.76 55.03,62.03 RPI-CM4.48
  Bottom 0.152: v53.3,62.76 41.91,62.76 33.06,71.6 19.23,71.6 18.59,72.24 16.76,72.24 J2.13
GPA0
  Top 0.305: MCP2.21 91.82,81.28 93.34,79.75 93.34,51.44 96.52,48.26 | 96.52,48.26 | 96.52,48.26 96.52,45.09 95.89,44.45 R18.1
GPA1
  Top 0.305: MCP2.22 91.82,80.01 92.71,79.12 92.71,51.06 95.52,48.26 R17.1
GPA2
  Top 0.305: MCP2.23 86.36,78.74 85.72,79.38 85.72,81.28 84.45,82.55 R11.1
GPA3
  Top 0.305: MCP2.24 86.36,77.47 85.09,78.74 85.09,80.01 84.45,80.64 R12.1
GPA4
  Top 0.305: MCP2.25 86.62,76.2 R13.1
GPA5
  Top 0.305: MCP2.26 85.99,74.93 R14.1
GPA6
  Top 0.305: MCP2.27 85.36,73.66 R15.1
GPA7
  Top 0.305: MCP2.28 84.72,72.39 R16.1
GPB0
  Top 0.305: MCP2.1 94.61,72.39 94.61,52.7 97.79,49.53 97.79,41.27 97.16,40.64 R20.1
GPB1
  Top 0.305: MCP2.2 93.98,73.66 93.98,52.07 97.16,48.9 97.16,43.18 96.52,42.55 R19.1
HDMI_CEC  (via drill 0.35)
  Top 0.152: RPI-CM4.151 24.75,62.83 24.18,63.4 24.18,72.75
  Top 0.175: 24.18,72.75 24.18,77.22 v28.8,81.84 | v28.5,83.21 28.53,83.24 28.53,89.4 28.26,89.68 28.26,90.85 HDMI0.P$13
  Bottom 0.175: v28.8,81.84 28.8,82.91 v28.5,83.21
HDMI_CLK_N
  Top 0.175: RPI-CM4.190 22.03,70.43 21.74,70.71 21.74,77.52 27.45,83.23 27.45,84.42 arc-90 27.62,84.59 27.72,84.59 arc90 27.89,84.75 27.89,85.47 arc90 27.72,85.64 27.62,85.64 arc-90 27.45,85.8 27.45,89.46 27.78,89.78 HDMI0.P$12
HDMI_CLK_P
  Top 0.175: RPI-CM4.188 21.96,70.03 21.41,70.58 21.41,77.66 27.13,83.37 27.13,89.46 26.78,89.81 HDMI0.P$10
HDMI_D0_N
  Top 0.175: RPI-CM4.184 21.4,69.23 21.08,69.55 21.08,84.02 24.69,87.63 arc-90 24.92,87.63 24.99,87.56 arc90 25.22,87.56 25.82,88.17 arc90 25.82,88.4 25.76,88.47 arc-90 25.76,88.7 25.93,88.87 25.93,89.46 26.28,89.8 HDMI0.P$9
HDMI_D0_P
  Top 0.175: RPI-CM4.182 21.33,68.83 20.75,69.41 20.75,84.16 25.6,89.01 25.6,89.46 25.28,89.79 HDMI0.P$7
HDMI_D1_N
  Top 0.175: RPI-CM4.178 21.38,68.03 20.43,68.98 20.43,84.89 22.78,87.25 arc-90 23.02,87.25 23.08,87.19 arc90 23.31,87.19 23.85,87.73 arc90 23.85,87.96 23.79,88.02 arc-90 23.79,88.25 24.41,88.87 24.41,89.56 24.78,89.93 HDMI0.P$6
HDMI_D1_P
  Top 0.175: RPI-CM4.176 21.32,67.63 20.1,68.84 20.1,85.03 24.08,89.01 24.08,89.61 23.78,89.92 HDMI0.P$4
HDMI_D2_N
  Top 0.175: RPI-CM4.172 20.95,66.83 19.71,68.07 19.71,85.85 20.88,87.02 arc-90 21.11,87.02 21.17,86.96 arc90 21.4,86.96 21.92,87.47 arc90 21.92,87.7 21.86,87.77 arc-90 21.86,88 22.94,89.08 22.94,89.53 23.28,89.87 HDMI0.P$3
HDMI_D2_P
  Top 0.175: RPI-CM4.170 20.89,66.43 19.38,67.94 19.38,85.99 22.55,89.16 22.55,89.61 22.25,89.92 22.25,90.84 HDMI0.P$1
HDMI_HOT
  Top 0.152: RPI-CM4.153 25.16,63.23 24.94,63.45 24.59,63.8 24.59,72.75
  Top 0.175: 24.59,72.75 24.59,75.79 31.28,82.48 HDMI0.P$19
HDMI_SCL
  Top 0.152: RPI-CM4.200 22.55,72.57 22.55,73.56 | 29.31,90.86 HDMI0.P$15
  Top 0.175: 22.55,73.56 22.55,76.35 29.31,83.11 29.31,90.86
HDMI_SDA  (via drill 0.35)
  Top 0.152: v31.77,85.72 32.3,85.19 32.3,81.37 | v29.84,87.63 29.78,87.7 HDMI0.P$16
  Top 0.175: RPI-CM4.199 25.5,74.57 32.3,81.37
  Bottom 0.152: v31.77,85.72 31.75,85.72 v29.84,87.63
ID_SC  (via drill 0.35)
  Top 0.152: v53.23,50.69 52.95,50.69 48.44,46.18 22.57,46.18 20.82,47.92 20.82,53.64 19.77,54.69 19.66,54.8 18.81,55.65 J2.28 | RPI-CM4.35 59.83,59.63 61.72,57.74 61.72,51.66 60.81,50.75 60.81,50.67 v60.58,50.44
  Bottom 0.152: v60.58,50.44 60.38,50.64 53.27,50.64 v53.23,50.69
ID_SD
  Top 0.152: RPI-CM4.36 55.21,59.63 54.41,58.83 54.41,52.72 48.17,46.48 22.68,46.48 21.1,48.06 21.1,53.76 19.51,55.35 19.51,56.39 18.9,57 16.46,57 15.57,56.11 J2.27
LED0A2
  Top 0.305: R1.1 67.76,98.35 44.58,98.35 42.06,95.83 15.88,95.83 11.02,90.98 6.81,90.98 4.45,88.62 4.45,12.78 5.49,11.74 BUZZER6.3 7.58,11.68 9.14,11.68 9.96,12.5 9.96,16.88 14.07,21 15.53,21 X2.13
LED0A3  (via drill 0.35)
  Top 0.203: 68.68,93.47 68.95,93.2 R2.1
  Top 0.305: 68.68,93.47 68.68,94.11 65.05,97.74 44.81,97.74 42.47,95.4 16.51,95.4 11.28,90.17 7.29,90.17 5.08,87.96 5.08,28.15 BUZZER5.3 10.64,25.71 v10.64,25.68
  Bottom 0.305: v10.64,25.68 10.74,25.68 11.44,24.98 15.48,24.98 X2.11
LED0A4  (via drill 0.35)
  Top 0.305: BUZZER4.3 5.71,39.68 5.71,86.36 6.35,87 8.89,87 16.87,94.97 42.88,94.97 45.03,97.13 64.85,97.13 67.46,94.51 67.46,89 68.2,88.27 R3.1 | v9.4,36.32 9.4,33.27 13.64,29.04 14.74,29.04 15.54,28.24 15.54,27.14 16.49,26.18 X2.9
  Bottom 0.305: v9.4,36.32 7.52,38.2 BUZZER4.3
LED0B0
  Top 0.305: R10.1 81.92,36.2 81.92,32.38 80.42,30.89 80.42,10.57 73.66,3.81 27.09,3.81 | BUZZER7.3 29.54,6.25 27.09,3.81 | 27.09,3.81 12.7,3.81 11.18,5.33 11.18,14.17 13.98,16.98 15.1,16.98 15.99,17.87 16.39,17.87 X2.17
LED0B1  (via drill 0.35)
  Top 0.305: BUZZER8.3 43.51,4.45 | 43.51,4.45 73.03,4.45 79.78,11.2 79.78,31.47 80.64,32.33 80.64,38.99 R9.1 | 43.51,4.45 29.97,4.45 v29.97,4.57 | v25.91,4.57 12.95,4.57 11.68,5.84 11.68,13.53 13.07,14.92 14.85,14.92 15.89,15.97 X2.19
  Bottom 0.305: v29.97,4.57 v25.91,4.57
LED1A0  (via drill 0.35)
  Top 0.305: BUZZER9.3 57.48,5.08 | 57.48,5.08 72.39,5.08 79.17,11.86 79.17,32.18 80.01,33.02 80.01,44.45 80.64,45.09 R8.1 | 57.48,5.08 v44.2,5.08 | v42.29,5.08 31.5,5.08 v31.24,5.33 | v27.18,5.33 13.72,5.33 12.45,6.6 12.45,11.57 13.8,12.93 15.45,12.93 X2.21
  Bottom 0.305: v31.24,5.33 v27.18,5.33 | v44.2,5.08 v42.29,5.08
LED1A1  (via drill 0.35)
  Top 0.305: R7.1 80.77,49.66 79.38,48.26 79.38,33.66 78.49,32.77 78.49,12.45 71.75,5.71 | v32.13,6.1 32.64,5.59 41.53,5.59 v42.04,6.1 | v45.47,6.1 45.97,5.59 56.9,5.59 v56.9,5.84 | X2.25 16.49,7 17.46,6.03 26.35,6.03 v26.42,6.1 | v58.8,5.84 58.93,5.71 71.75,5.71 | BUZZER0.3 71.75,7.21 71.75,5.71
  Bottom 0.305: v26.42,6.1 v32.13,6.1 | v42.04,6.1 v45.47,6.1 | v58.8,5.84 v56.9,5.84
LED1A5  (via drill 0.35)
  Top 0.305: R4.1 68.95,84.08 66.67,86.36 66.67,94.49 64.47,96.7 45.21,96.7 43.05,94.54 17.3,94.54 10.03,87.27 v10.03,53.98 10.03,37.72 10.38,37.37 10.38,34.17 13.66,30.9 16.22,30.9 16.49,30.62 X2.5
  Bottom 0.305: v10.03,53.98 10.03,53.65 BUZZER3.3
LED1A6  (via drill 0.35)
  Top 0.305: R5.1 65.86,82.47 65.86,94.28 64.03,96.11 45.24,96.11 43.23,94.11 17.88,94.11 11.99,88.21 11.99,67.51 v12.04,67.46 13.46,66.04 13.46,38.26 15.45,36.27 15.45,33.01 X2.3
  Bottom 0.305: v12.04,67.46 7.68,67.46 BUZZER2.3
LED1A7  (via drill 0.35)
  Top 0.305: R6.1 68.58,74.93 65.15,78.36 65.15,93.75 63.22,95.68 45.7,95.68 43.69,93.67 18.36,93.67 12.7,88.01 v12.7,81.92 12.7,68.33 13.97,67.06 13.97,40.13 16.49,37.61 X2.1
  Bottom 0.305: v12.7,81.92 12.38,81.59 BUZZER1.3
MISO  (via drill 0.35)
  Top 0.305: U1.16 73.02,16.97 73.02,18.59 71.12,20.5 v71.12,20.95
  Bottom 0.305: v71.12,20.95 69.93,22.14 69.93,27.9 70.48,28.46 70.48,36.83 69.22,38.1 69.22,43.18 68.58,43.81 67.31,43.81 66.67,44.45 66.67,46.35 ICSP.1
MOSI  (via drill 0.35)
  Top 0.305: v72.47,39.37 72.47,44.37 71.75,45.09 ICSP.4 | v72.39,18.41 72.49,18.31 U1.15
  Bottom 0.305: v72.47,39.37 72.47,36.73 72.63,36.56 72.63,31.36 71.75,30.48 71.75,29.21 73.66,27.3 73.66,24.77 72.39,23.5 v72.39,18.41
N$1
  Top 0.305: R14.2 81.92,76.83 79.38,79.38 79.38,84.45 78.91,84.92 T4.1
N$2
  Top 0.305: T4.2 75.66,84.92 R4.2
N$3
  Top 0.305: R42.1 27.64,23.75 D3.3 23.71,23.24 R32.2
N$4  (via drill 0.35)
  Top 0.152: v63.4,61.98 63.32,61.98 62.4,62.9 62.4,69.14 62.96,69.7 R73.2 | v60.33,56.4 59.9,56.83 RPI-CM4.21
  Bottom 0.152: v63.4,61.98 63.4,58.27 61.53,56.4 v60.33,56.4
N$5
  Top 0.305: R16.2 81.42,73.03 T6.1
N$6
  Top 0.305: R41.1 27.26,27.43 D2.3 23,27.56 R31.2
N$7
  Top 0.305: R37.2 D8.3 R47.1
N$8
  Top 0.305: R6.2 75.66,76.03 T6.2
N$9
  Top 0.305: R30.2 22.88,31.11 D1.3 R40.1
N$10
  Top 0.305: T5.1 78.42,79.06 82.28,75.19 R15.2
N$11
  Top 0.305: T5.2 75.66,80.47 R5.2
N$12
  Top 0.305: R35.2 D6.3 R45.1
N$13
  Top 0.305: R49.1 56.9,24.01 D10.3 R39.2
N$14
  Top 0.305: R18.2 93.72,44.91 93.03,44.91 T8.1
N$15
  Top 0.305: R36.2 D7.3 R46.1
N$16
  Top 0.305: T8.2 88.99,46.19 R8.2
N$17
  Top 0.305: R38.2 D9.3 R48.1
N$18
  Top 0.305: T7.1 91.75,48.58 93.72,46.62 R17.2
N$19
  Top 0.305: R33.2 27.11,19.96 D4.3 R43.1
N$20
  Top 0.305: T7.2 88.86,50.63 R7.2
N$21
  Top 0.305: T9.1 92.56,42.55 R19.2
N$22
  Top 0.305: T9.2 88.99,41.74 R9.2
N$23
  Top 0.305: LED3.C 66.81,69.7 R73.1
N$24
  Top 0.305: R20.2 93.72,37.98 93.36,37.62 T10.1
N$25
  Top 0.305: T10.2 89.06,37.62 87.89,36.45 R10.2
N$26
  Top 0.305: T1.1 78.42,98.11 81.92,94.61 81.92,82.92 R11.2
N$27
  Top 0.305: R1.2 74.78,97.16 75.89,98.25 T1.2
N$28
  Top 0.305: R12.2 81.92,80.64 80.64,81.92 80.64,91.58 T2.1
N$29
  Top 0.305: T2.2 75.42,92.71 R2.2
N$30
  Top 0.305: R13.2 82.28,79 80.01,81.28 80.01,88.9 79.55,89.36 T3.1
N$31
  Top 0.305: T3.2 75.42,88.27 R3.2
N$32
  Top 0.305: R74.1 LED1.C
N$33
  Top 0.305: Y1.3 66.24,17.27 U1.8
N$34
  Top 0.305: R44.1 D5.3 22.97,15.62 R34.2
N$35
  Top 0.305: T11.1 89.91,32.16 R75.2
N$36
  Top 0.305: T11.2 90.32,29.84 90.81,29.84 92.45,28.2 R76.2
N$37
  Top 0.305: R75.1 97.18,33.02 RLSBT.3
N$41
  Top 0.305: D11.3 82.28,29.01 R61.2 83.56,27.3 84.83,27.3 85.46,26.67 R62.1
N$43
  Top 0.305: Y1.1 62.5,18.68 62.87,19.05 66.14,19.05 U1.7
N$44  (via drill 0.35)
  Top 0.305: U1.20 75.79,20.55 76.2,20.95 76.2,26.04 v74.93,27.3 | v72.39,29.84 69.21,29.84 C14.1
  Bottom 0.305: v74.93,27.3 v72.39,29.84
OA
  Top 0.305: MCP1.23 85.09,59.69 82.18,62.6 R23.1
OB
  Top 0.305: R24.1 84.72,58.42 MCP1.24
OC
  Top 0.305: MCP1.26 83.45,55.88 R26.1
OD
  Top 0.305: MCP1.27 83.19,54.61 82.55,55.24 R27.1
ODP
  Top 0.305: MCP1.25 84.08,57.15 R25.1
OE
  Top 0.305: R28.1 82.31,53.48 87.24,53.48 MCP1.28
OF
  Top 0.305: MCP1.22 86.36,60.96 82.55,64.77 R22.1
OG
  Top 0.305: MCP1.21 86.36,62.23 82.18,66.41 R21.1
RESET  (via drill 0.35)
  Top 0.305: U1.29 70.08,26.44 69.54,26.98 65.96,26.98 R60.1 64.61,26.52 v64.77,26.67
  Bottom 0.305: ICSP.5 67.94,41.91 63.5,37.47 63.5,31.75 64.77,30.48 v64.77,26.67
RLBTLED  (via drill 0.35)
  Top 0.305: v96.52,52.07 98.42,50.16 98.42,27.05 R76.1 | v94.61,74.93 MCP2.3
  Bottom 0.305: v96.52,52.07 94.31,54.28 94.31,74.63 v94.61,74.93
RLSBT
  Top 0.305: R61.1 84.08,25.4 84.72,24.77 87.66,24.77 88.27,25.37 88.27,33.02 89.53,34.29 91.44,34.29 92.08,34.92 97.12,34.92 RLSBT.2
RX  (via drill 0.35)
  Top 0.305: v67.31,56.52 Q2.3 66.77,57.32 R68.1 | v65.41,52.07 64.9,51.56 64.9,33.53 v65.41,33.02 | v69.22,26.43 69.29,26.35 U1.30
  Bottom 0.305: v67.31,56.52 67.31,53.98 v65.41,52.07 | v65.41,33.02 68.58,33.02 69.22,32.38 v69.22,26.43
RXD  (via drill 0.35)
  Top 0.152: v63.5,56.52 62.87,57.15 62.87,59.35 60.96,61.25 60.96,61.86 60.09,62.73 59.59,62.73 RPI-CM4.51 58.48,62.83 58.22,63.09 58.22,63.7 v57.76,64.16 | v66.04,56.47 66.36,56.15 Q3.2
  Top 0.305: Q3.2 67.36,54.61 68.95,54.61 R66.1
  Bottom 0.152: v63.5,56.52 66,56.52 v66.04,56.47 | J2.10 20.22,80.62 26.98,80.62 43.28,64.31 57.61,64.31 v57.76,64.16
SCK  (via drill 0.35)
  Top 0.305: U1.17 76.58,18.16 77.47,19.05 v77.47,31.11 | ICSP.3 68.58,45.09 69.85,43.81 v71.75,43.81
  Bottom 0.305: v77.47,31.11 77.47,33.66 78.74,34.92 78.74,36.83 v71.75,43.81
SCL  (via drill 0.35)
  Top 0.305: MCP1.12 v98.42,67.31 v98.42,51.44 | v77.47,51.44 77.28,51.24 77.28,49.05 R71.1 78.14,48.18 78.14,34.33 70.89,27.08 U1.28 | v98.42,69.85 98.42,86.36 MCP2.12
  Bottom 0.305: v98.42,51.44 v77.47,51.44 | v98.42,69.85 v98.42,67.31
SCLPI  (via drill 0.35)
  Top 0.152: RPI-CM4.80 55.32,68.43 v53.09,68.43
  Bottom 0.152: J2.5 16.84,84.86 20.14,84.86 23.55,81.46 27.32,81.46 40.35,68.43 v53.09,68.43
SDA  (via drill 0.35)
  Top 0.305: MCP1.13 99.06,68.58 | v99.06,50.16 99.06,68.58 | MCP2.13 98.42,87.63 99.06,87 99.06,68.58 | v79.38,50.16 79.35,50.19 78.74,50.19 | 78.74,50.19 R70.1 | 78.74,50.19 78.74,33.96 71.68,26.9 U1.27
  Bottom 0.305: v99.06,50.16 v79.38,50.16
SDAPI  (via drill 0.35)
  Top 0.152: RPI-CM4.82 54.08,68.83 53.99,68.92 | v53.81,68.92 53.99,68.92 | 53.99,68.92
  Bottom 0.152: J2.3 16.74,87.3 19.2,87.3 19.81,86.69 19.81,85.64 23.71,81.74 27.44,81.74 40.25,68.92 v53.81,68.92
TX  (via drill 0.35)
  Top 0.305: Q3.3 64.97,53.51 R69.1 64.26,53.2 64.26,32.89 v65.02,32.13 | v68.53,26.43 68.53,25.25 U1.31
  Bottom 0.305: v65.02,32.13 67.56,32.13 68.5,31.19 68.5,26.46 v68.53,26.43
TXD  (via drill 0.35)
  Top 0.152: v57.76,65.08 58.52,64.31 58.52,63.86 58.75,63.63 RPI-CM4.55 60.93,63.63 64.24,60.33 66,60.33 66.04,60.33 66.36,60.33 | R65.1 69.85,60.33 66.36,60.33 | 66.36,60.33 Q2.2
  Bottom 0.152: v57.76,65.08 57.36,65.47 42.91,65.47 27.21,81.18 18.24,81.18 J2.8
USB_N
  Top 0.229: RPI-CM4.103 26.3,53.23 26.32,53.25 26.46,53.25 31.67,58.46 31.67,72.34 34.92,75.59 46.26,75.59 55.12,84.45 55.12,87.88 D14.2 55.31,88.71 55.9,89.3 55.9,90.6 USB0.D-
USB_P
  Top 0.229: RPI-CM4.105 26.3,53.63 31.29,58.62 31.29,72.5 34.77,75.97 43.97,75.97 arc90 44.16,76.16 44.16,76.23 arc-90 44.35,76.42 45.34,76.42 arc-90 45.53,76.23 45.53,76.16 arc90 45.72,75.97 46.1,75.97 54.74,84.61 54.74,87.95 D14.1 54.61,88.69 53.89,89.41 USB0.D+

## Text on the board
tPlace: BuzzerBox v5
tNames: 2021 | GoeffelDevices